# EAGLE design SAOA (EAGLE 9.6.2)
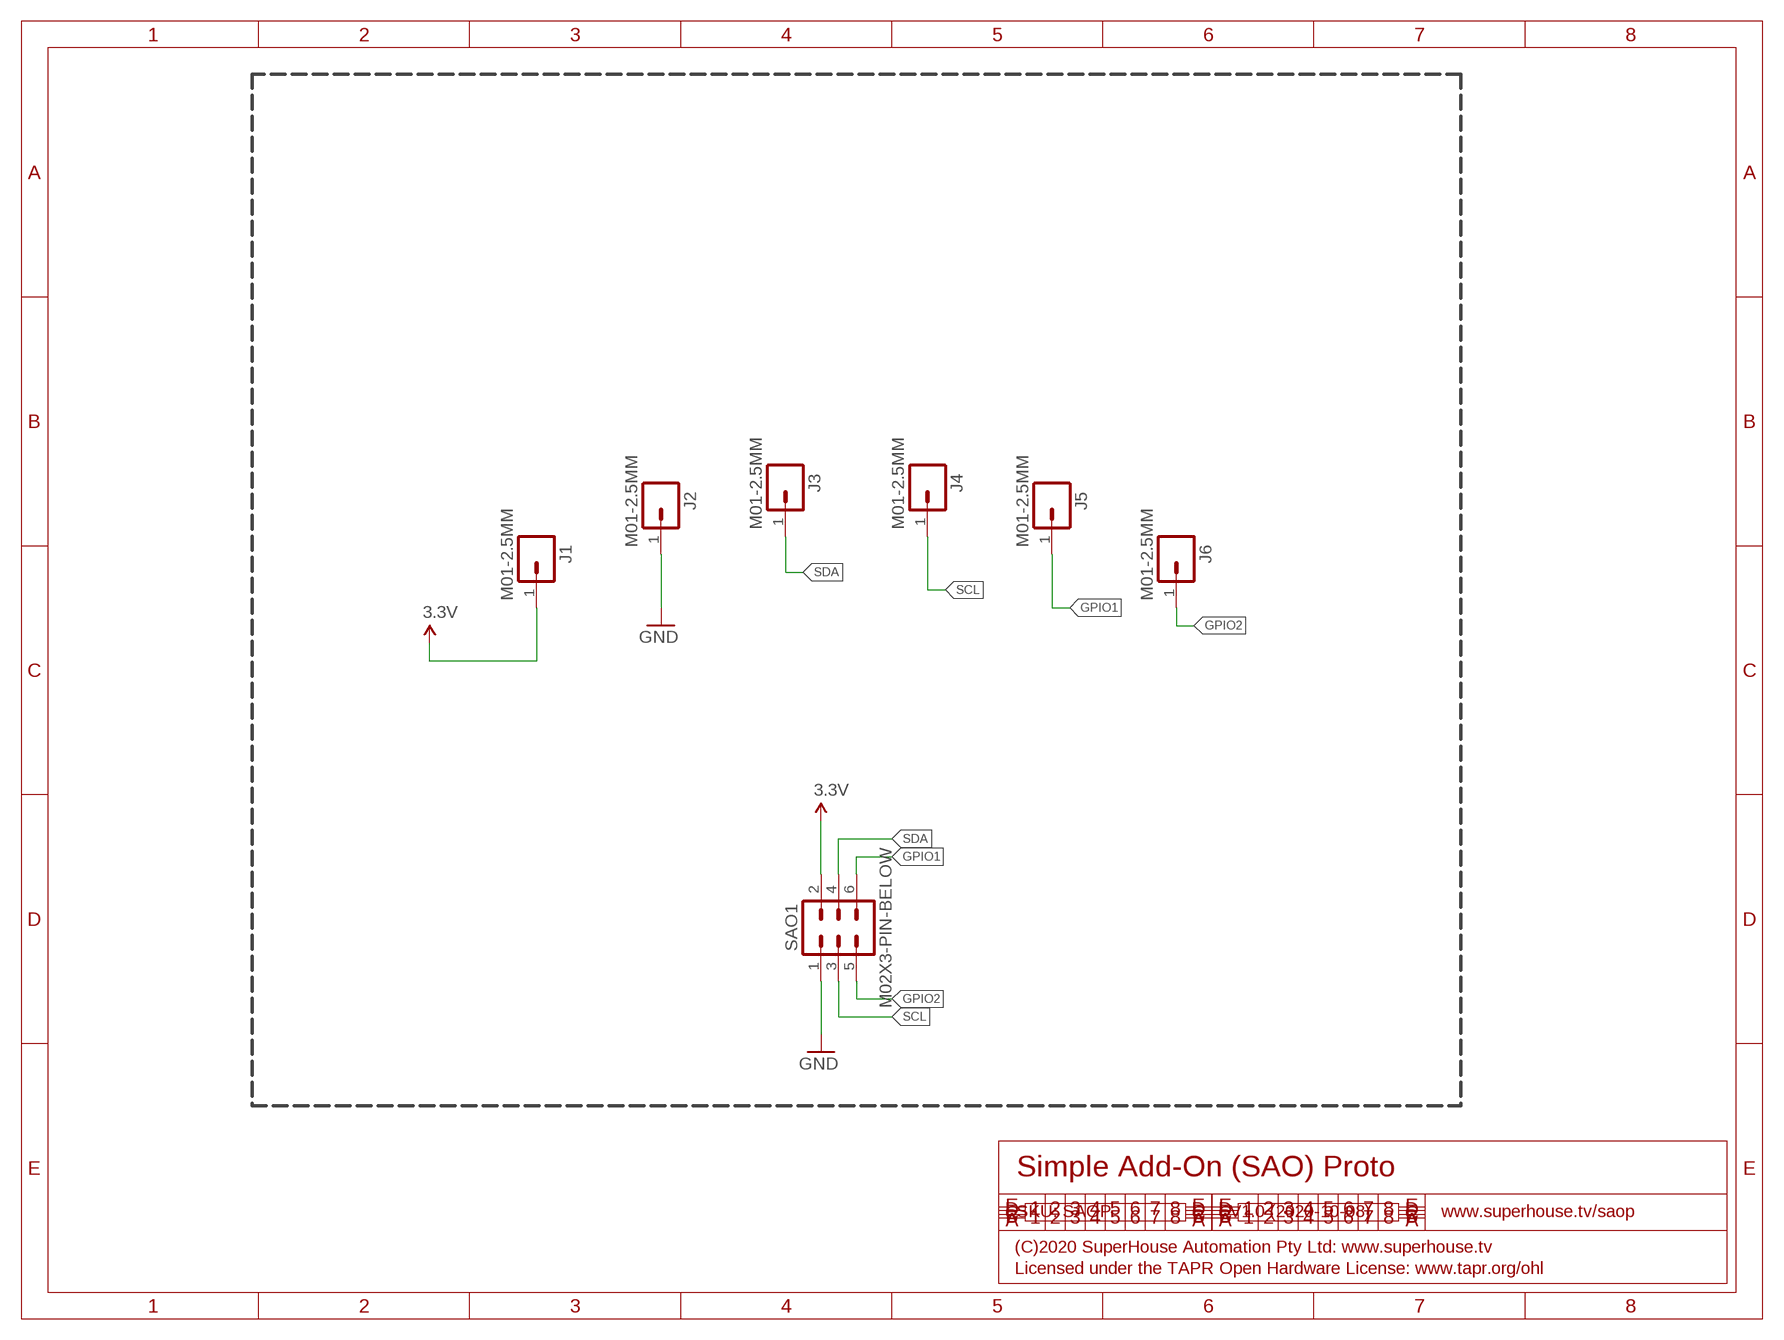
[diagram p0: schematic, sheet 1]

## Parts
J1  M01-2.5MM  [1X01-2.5MM]
J2  M01-2.5MM  [1X01-2.5MM]
J3  M01-2.5MM  [1X01-2.5MM]
J4  M01-2.5MM  [1X01-2.5MM]
J5  M01-2.5MM  [1X01-2.5MM]
J6  M01-2.5MM  [1X01-2.5MM]
SAO1  M02X3-PIN-BELOW  [2X03-P-BELOW]

## Nets
3.3V: J1.1 SAO1.2
GND: J2.1 SAO1.1
GPIO1: J5.1 SAO1.6
GPIO2: J6.1 SAO1.5
SCL: J4.1 SAO1.3
SDA: J3.1 SAO1.4

## Notes on the sheet
- Simple Add-On (SAO) Proto
- SKU: SAOP | V1.0 (2020-10-08) | www.superhouse.tv/saop
- (C)2020 SuperHouse Automation Pty Ltd: www.superhouse.tv
- Licensed under the TAPR Open Hardware License: www.tapr.org/ohl

## Library data of the parts
J1-J6 = SuperHouse-Connectors:M01: 1-way header Standard 1x1 header
SAO1 = SuperHouse-Connectors:M02X3: M6 header in 2x3 format

## Net classes
0 default: width 0.203 mm, drill 0.356 mm, clearance 0.152 mm
1 power: width 0.203 mm, clearance 0.152 mm

## Board
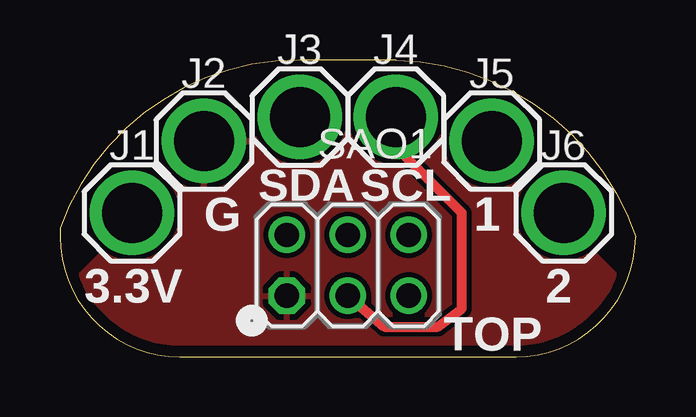
[diagram p1: board, top side]
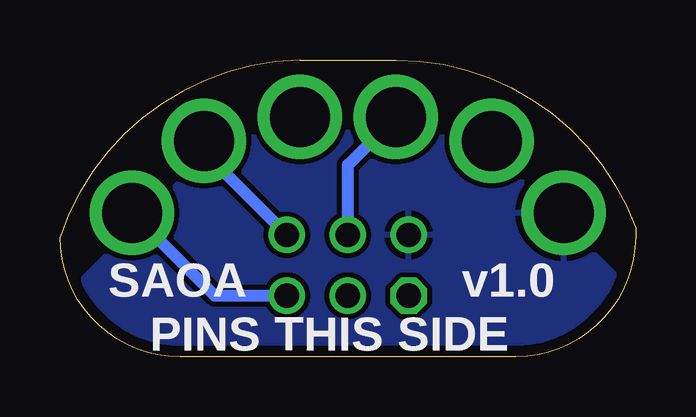
[diagram p2: board, bottom side, seen from below]

Size 24 x 12.38 mm. Coordinates in mm from the lower left corner, seen from the top.
Outline: 5,0 19,0 arc90 24,5 arc70 14,12.38 10,12.38 arc70 0,5.38 0,5 arc90 5,0
Copper layers (1*16): Top 0.035mm / dielectric 1.5mm / Bottom 0.035mm
Design rules "SuperHouse-Design-Rules": minimum track width 10mil, minimum drill 24mil, track to track 8mil, track to pad 8mil, pad to pad 8mil, via to via 8mil, smd to smd 6mil, copper to edge 18mil, drill to drill 8mil, minimum pad ring 7mil, minimum via ring 8mil, stop-mask expansion 4mil, vias tented up to drill 0.5mm, thermal gap 10mil
tRestrict: area -0.2,2.8 to 6.5,12.5; area 17.5,2.8 to 24.2,12.5
bRestrict: area -0.2,2.8 to 6.5,12.5; area 17.5,2.5 to 24.2,12.5

### Footprints (pad centres in the part's own frame; a part is rotated, then mirrored left to right if it is on the bottom)
1X01-2.5MM = drill 2.5: 1 0,0
2X03-P-BELOW = drill 1.016 octagon: 1 -2.54,-1.27 | drill 1.016: 2 -2.54,1.27; 3 0,-1.27; 4 0,1.27; 5 2.54,-1.27; 6 2.54,1.27

### Placement (x,y rotation side)
J1  3,6 0 top
J2  6,9 0 top
J3  10,10 0 top
J4  14,10 0 top
J5  18,9 0 top
J6  21,6 0 top
SAO1  12,3.81 0 top

### Tracks (layer width: path | path; a pad name or v marks a point on that pad's centre or on a via)
3.3V
  pour Bottom: 4.38,0 arc-90 0,5.38 arc-70 10,12.38 14,12.38 arc-70 24,5 arc-90 19.62,0
GND
  pour Top: 19.62,0 4.38,0 arc-90 0,5.38 arc-70 10,12.38 14,12.38 arc-70 24,5 arc-90
GPIO1
  Bottom 0.508: SAO1.6 18,8.54 J5.1
GPIO2
  Bottom 0.508: SAO1.5 17.54,2.54 J6.1
SCL
  Top 0.406: SAO1.3 13.54,1.25 15.75,1.25 16.75,2 16.75,6 14,8.75 J4.1
SDA
  Bottom 0.508: SAO1.4 12,8 J3.1

### Text on the board
tPlace: SDA | SCL | G | 1 | 3.3V | 2 | TOP
bPlace: v1.0 | SAOA | PINS THIS SIDE